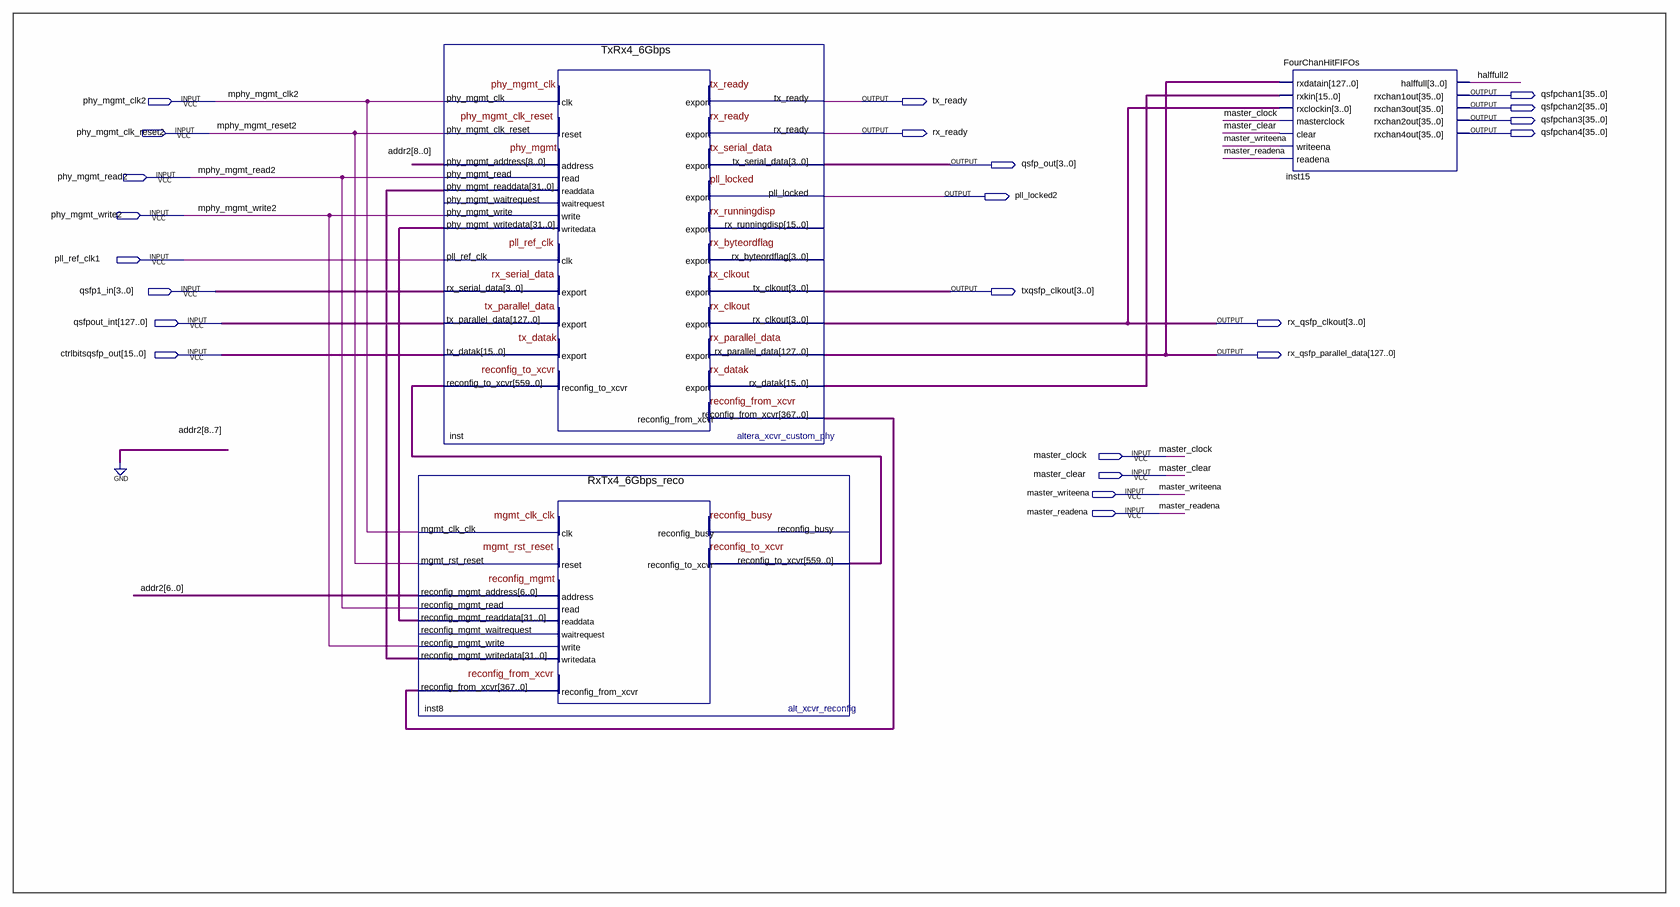
[diagram p0: schematic sheet]
// Quartus schematic GxBlock.bdf as structural Verilog: 3 symbols, 23 pins
module GxBlock (
  input  phy_mgmt_clk2,
  input  phy_mgmt_clk_reset2,
  input  phy_mgmt_read2,
  input  phy_mgmt_write2,
  input  pll_ref_clk1,
  input  [3:0] qsfp1_in,
  input  [127:0] qsfpout_int,
  input  [15:0] ctrlbitsqsfp_out,
  input  master_clock,
  input  master_clear,
  input  master_writeena,
  input  master_readena,
  output [35:0] qsfpchan1,
  output tx_ready,
  output [35:0] qsfpchan2,
  output [35:0] qsfpchan3,
  output rx_ready,
  output [35:0] qsfpchan4,
  output [3:0] qsfp_out,
  output pll_locked2,
  output [3:0] txqsfp_clkout,
  output [3:0] rx_qsfp_clkout,
  output [127:0] rx_qsfp_parallel_data
);

  wire halffull2;
  wire [6:0] addr2;
  wire [15:0] inst_rx_datak;
  wire [31:0] inst8_reconfig_mgmt_readdata, inst_phy_mgmt_readdata;
  wire [367:0] inst_reconfig_from_xcvr;
  wire [559:0] inst8_reconfig_to_xcvr;

  TxRx4_6Gbps inst (
    .phy_mgmt_clk(phy_mgmt_clk2), .phy_mgmt_clk_reset(phy_mgmt_clk_reset2),
    .phy_mgmt_address({2'b00, addr2}), .phy_mgmt_read(phy_mgmt_read2), .phy_mgmt_write(phy_mgmt_write2),
    .phy_mgmt_writedata(inst8_reconfig_mgmt_readdata), .pll_ref_clk(pll_ref_clk1), .rx_serial_data(qsfp1_in),
    .tx_parallel_data(qsfpout_int), .tx_datak(ctrlbitsqsfp_out), .reconfig_to_xcvr(inst8_reconfig_to_xcvr),
    .phy_mgmt_readdata(inst_phy_mgmt_readdata), .tx_ready(tx_ready), .rx_ready(rx_ready),
    .tx_serial_data(qsfp_out), .pll_locked(pll_locked2), .tx_clkout(txqsfp_clkout),
    .rx_clkout(rx_qsfp_clkout), .rx_parallel_data(rx_qsfp_parallel_data), .rx_datak(inst_rx_datak),
    .reconfig_from_xcvr(inst_reconfig_from_xcvr));  // open: phy_mgmt_waitrequest, rx_runningdisp, rx_byteordflag
  RxTx4_6Gbps_reco inst8 (
    .mgmt_clk_clk(phy_mgmt_clk2), .mgmt_rst_reset(phy_mgmt_clk_reset2), .reconfig_mgmt_address(addr2),
    .reconfig_mgmt_read(phy_mgmt_read2), .reconfig_mgmt_write(phy_mgmt_write2),
    .reconfig_mgmt_writedata(inst_phy_mgmt_readdata), .reconfig_from_xcvr(inst_reconfig_from_xcvr),
    .reconfig_mgmt_readdata(inst8_reconfig_mgmt_readdata), .reconfig_to_xcvr(inst8_reconfig_to_xcvr));  // open: reconfig_busy, reconfig_mgmt_waitrequest
  FourChanHitFIFOs inst15 (
    .rxdatain(rx_qsfp_parallel_data), .rxkin(inst_rx_datak), .rxclockin(rx_qsfp_clkout),
    .masterclock(master_clock), .clear(master_clear), .writeena(master_writeena), .readena(master_readena),
    .halffull(halffull2), .rxchan1out(qsfpchan1), .rxchan3out(qsfpchan2), .rxchan2out(qsfpchan3),
    .rxchan4out(qsfpchan4));

  // Other names for the same wires on the sheet: mphy_mgmt_clk2 = phy_mgmt_clk2; mphy_mgmt_read2 = phy_mgmt_read2;
  //   mphy_mgmt_reset2 = phy_mgmt_clk_reset2; mphy_mgmt_write2 = phy_mgmt_write2
endmodule
